# EAGLE design ioboard (EAGLE 9.6.2)
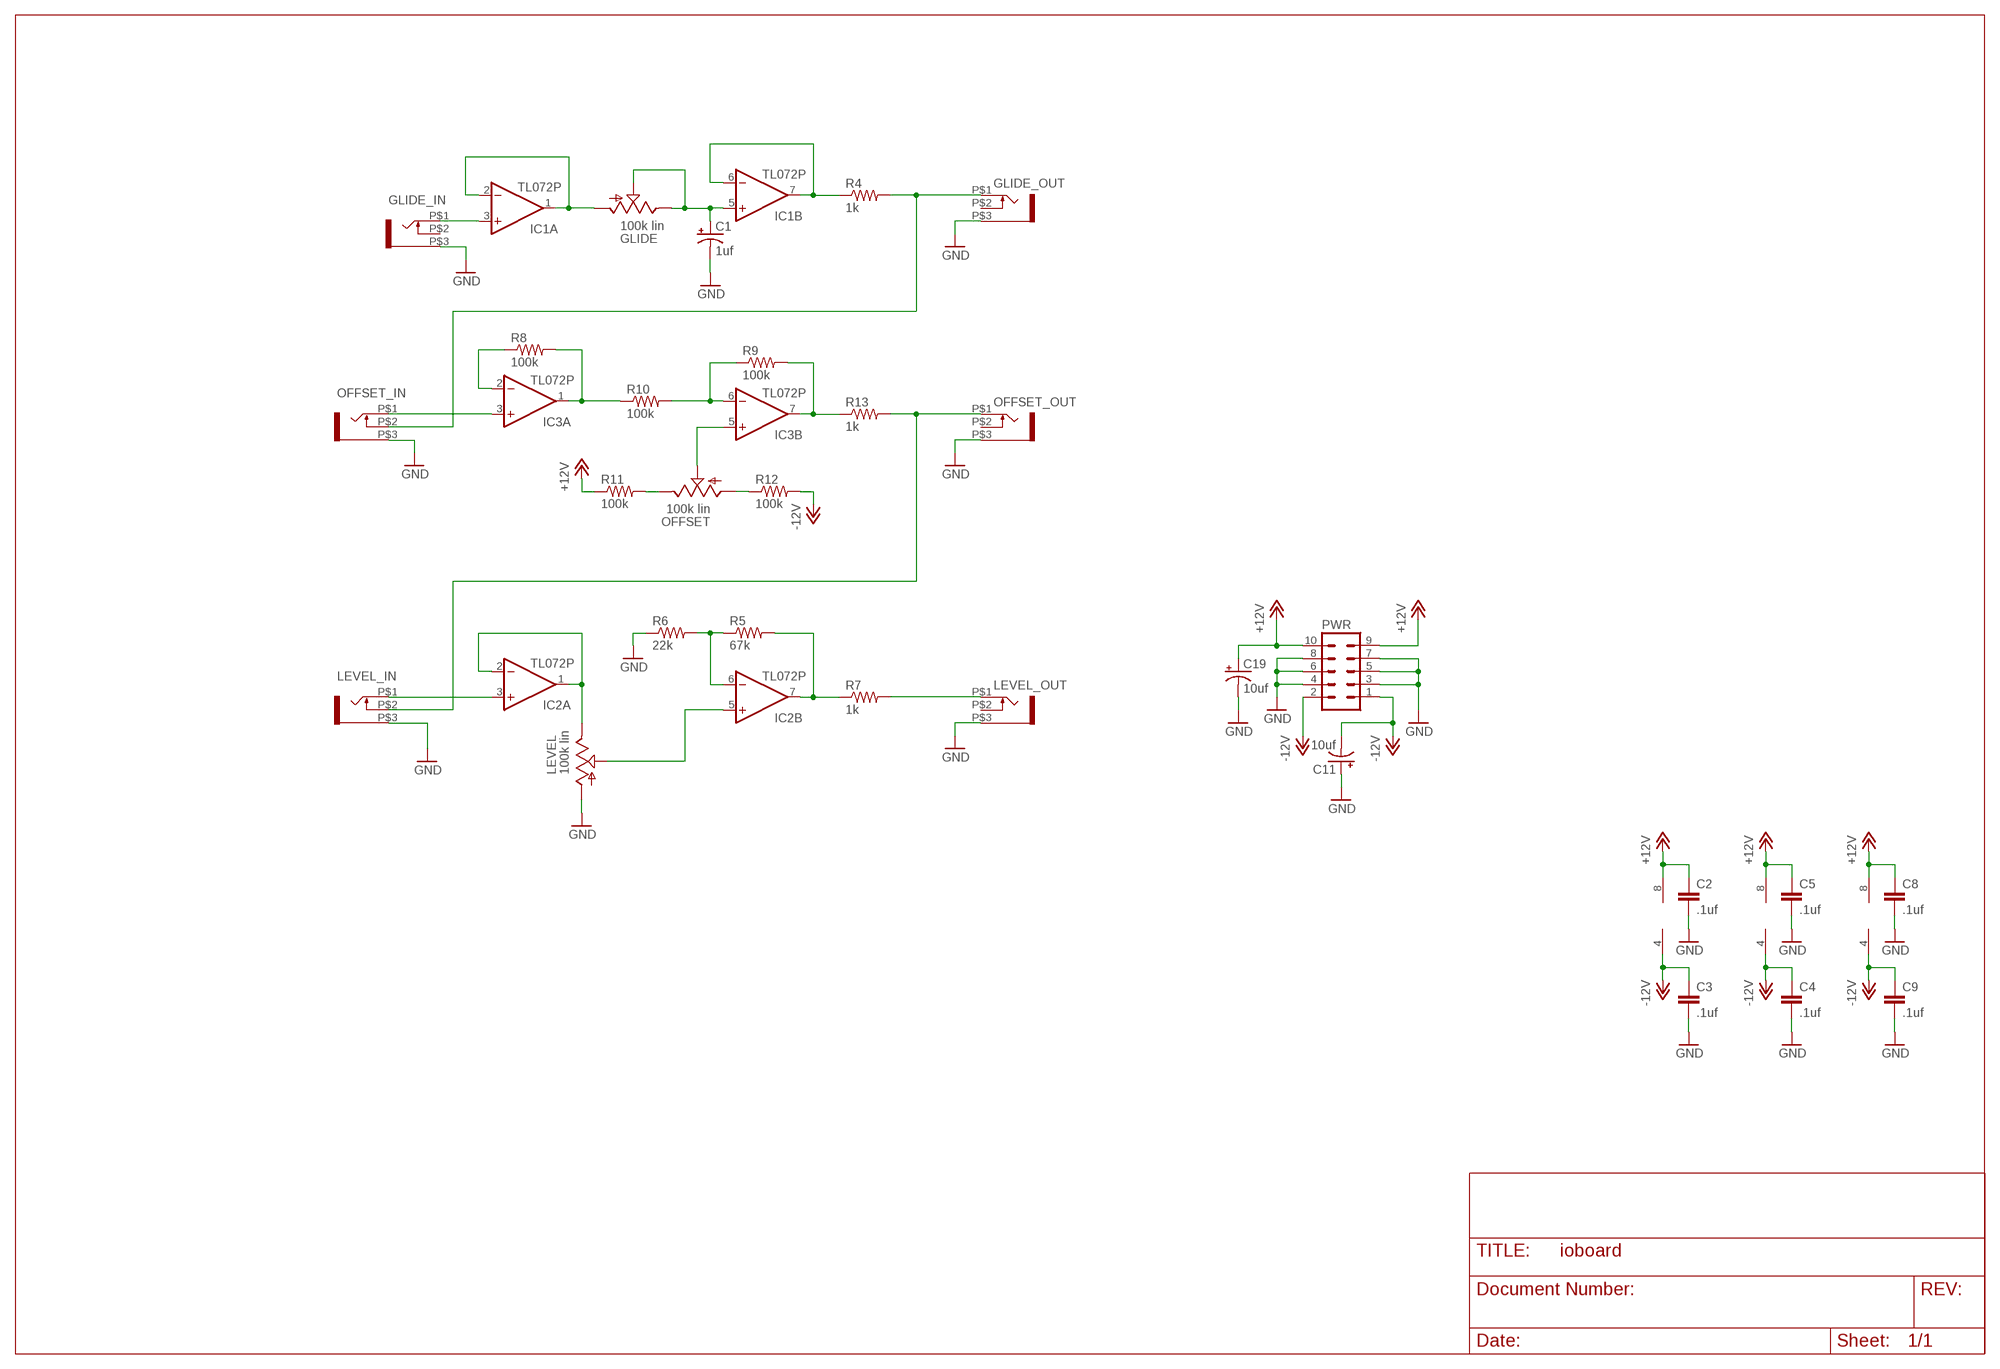
[diagram p0: schematic, sheet 1]

## Parts
C1  1uf  CPOL-USE2.5-6  [E2,5-6]
C2  .1uf  C-EU050-024X044  [C050-024X044]
C3  .1uf  C-EU050-024X044  [C050-024X044]
C4  .1uf  C-EU050-024X044  [C050-024X044]
C5  .1uf  C-EU050-024X044  [C050-024X044]
C8  .1uf  C-EU050-024X044  [C050-024X044]
C9  .1uf  C-EU050-024X044  [C050-024X044]
C11  10uf  CPOL-USE2.5-5  [E2,5-5]
C19  10uf  CPOL-USE2.5-5  [E2,5-5]
GLIDE  100k lin  ALPHA-9MMA  [EVUF]
GLIDE_IN  WQP-PJ301M-12_JACK  [WQP-PJ301M-12_JACK]
GLIDE_OUT  WQP-PJ301M-12_JACK  [WQP-PJ301M-12_JACK]
IC1  TL072P  [DIL08]
IC2  TL072P  [DIL08]
IC3  TL072P  [DIL08]
LEVEL  100k lin  ALPHA-9MMA  [EVUF]
LEVEL_IN  WQP-PJ301M-12_JACK  [WQP-PJ301M-12_JACK]
LEVEL_OUT  WQP-PJ301M-12_JACK  [WQP-PJ301M-12_JACK]
OFFSET  100k lin  ALPHA-9MMA  [EVUF]
OFFSET_IN  WQP-PJ301M-12_JACK  [WQP-PJ301M-12_JACK]
OFFSET_OUT  WQP-PJ301M-12_JACK  [WQP-PJ301M-12_JACK]
PWR  ML10  [ML10]
R4  1k  R-US_0204/7  [0204/7]
R5  67k  R-US_0204/7  [0204/7]
R6  22k  R-US_0204/7  [0204/7]
R7  1k  R-US_0204/7  [0204/7]
R8  100k  R-US_0204/7  [0204/7]
R9  100k  R-US_0204/7  [0204/7]
R10  100k  R-US_0204/7  [0204/7]
R11  100k  R-US_0204/7  [0204/7]
R12  100k  R-US_0204/7  [0204/7]
R13  1k  R-US_0204/7  [0204/7]

## Nets
+12V: C2.1 C5.1 C8.1 C19.+ IC1.8(P:V+) IC2.8(P:V+) IC3.8(P:V+) PWR.9 PWR.10 R11.1
-12V: C3.1 C4.1 C9.1 C11.- IC1.4(P:V-) IC2.4(P:V-) IC3.4(P:V-) PWR.1 PWR.2 R12.2
GND: C1.- C2.2 C3.2 C4.2 C5.2 C8.2 C9.2 C11.+ C19.- GLIDE_IN.P$3 GLIDE_OUT.P$3 LEVEL.1(A) LEVEL_IN.P$3 LEVEL_OUT.P$3 OFFSET_IN.P$3 OFFSET_OUT.P$3 PWR.3 PWR.4 PWR.5 PWR.6 PWR.7 PWR.8 R6.1
IO_LEVEL_W: IC2.5(B:+IN) LEVEL.2(S)
IO_OFFSET_IN: IC3.3(A:+IN) OFFSET_IN.P$1
IO_OFFSET_OUT: LEVEL_IN.P$2 OFFSET_OUT.P$1 R13.2
IO_SLIDE_A: GLIDE.1(A) IC1.1(A:OUT) IC1.2(A:-IN)
IO_SLIDE_B: C1.+ GLIDE.2(S) GLIDE.3(E) IC1.5(B:+IN)
IO_SLIDE_IN: GLIDE_IN.P$1 IC1.3(A:+IN)
M_LEVEL_A: IC2.1(A:OUT) IC2.2(A:-IN) LEVEL.3(E)
M_LEVEL_IN: IC2.3(A:+IN) LEVEL_IN.P$1
M_LEVEL_OUT: LEVEL_OUT.P$1 R7.2
M_OFFSET: IC3.5(B:+IN) OFFSET.2(S)
M_SLIDE_OUT: GLIDE_OUT.P$1 OFFSET_IN.P$2 R4.2
N$4: IC1.6(B:-IN) IC1.7(B:OUT) R4.1
N$9: IC2.6(B:-IN) R5.1 R6.2
N$10: IC2.7(B:OUT) R5.2 R7.1
N$11: IC3.6(B:-IN) R9.1 R10.2
N$12: IC3.1(A:OUT) R8.2 R10.1
N$13: IC3.2(A:-IN) R8.1
N$14: IC3.7(B:OUT) R9.2 R13.1
N$17: OFFSET.1(A) R12.1
N$18: OFFSET.3(E) R11.2
Unconnected: GLIDE_IN.P$2 GLIDE_OUT.P$2 LEVEL_OUT.P$2 OFFSET_OUT.P$2

## Library data of the parts
C1 C11 C19 = resistor:CPOL-US: POLARIZED CAPACITOR, American symbol
C2-C5 C8 C9 = resistor:C-EU: CAPACITOR, European symbol
GLIDE LEVEL OFFSET = TomW:ALPHA-9MM: 9 mm Square Rotary Potentiometers Source: Panasonic
GLIDE_IN GLIDE_OUT LEVEL_IN LEVEL_OUT OFFSET_IN OFFSET_OUT = thonkiconn:WQP-PJ301M-12_JACK
IC1-IC3 = TomW:TL072: OP AMP
PWR = con-ml:ML10: HARTING; OC_FARNELL: unknown; OC_NEWARK: unknown
R4-R13 = resistor:R-US_: RESISTOR, American symbol

## Board
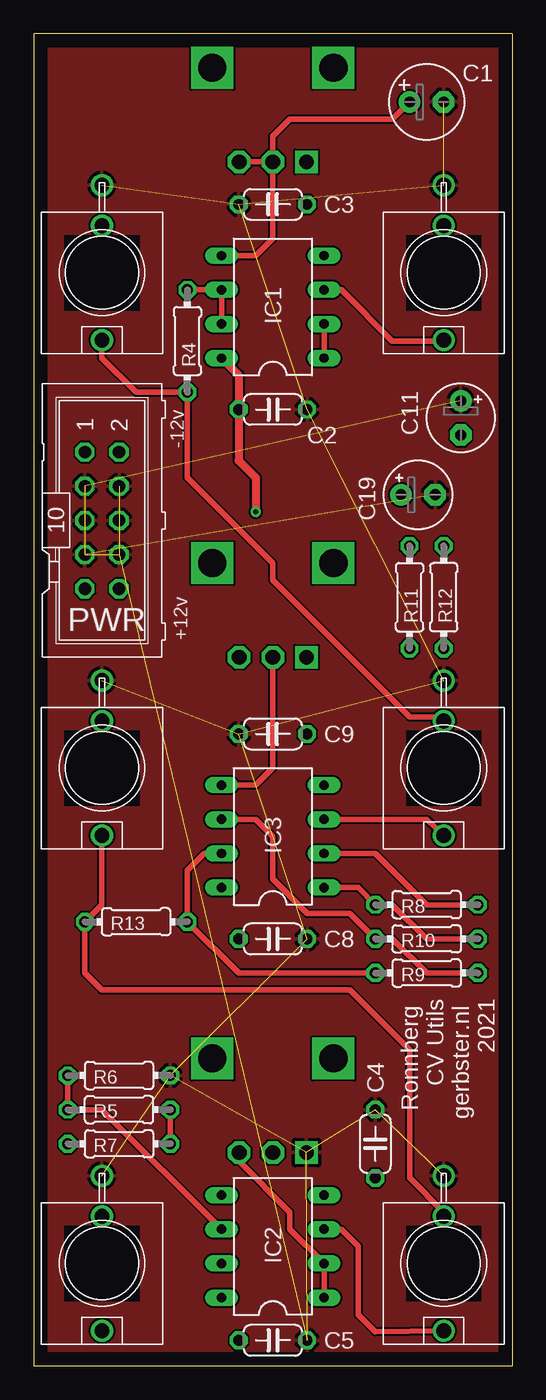
[diagram p1: board, top side]
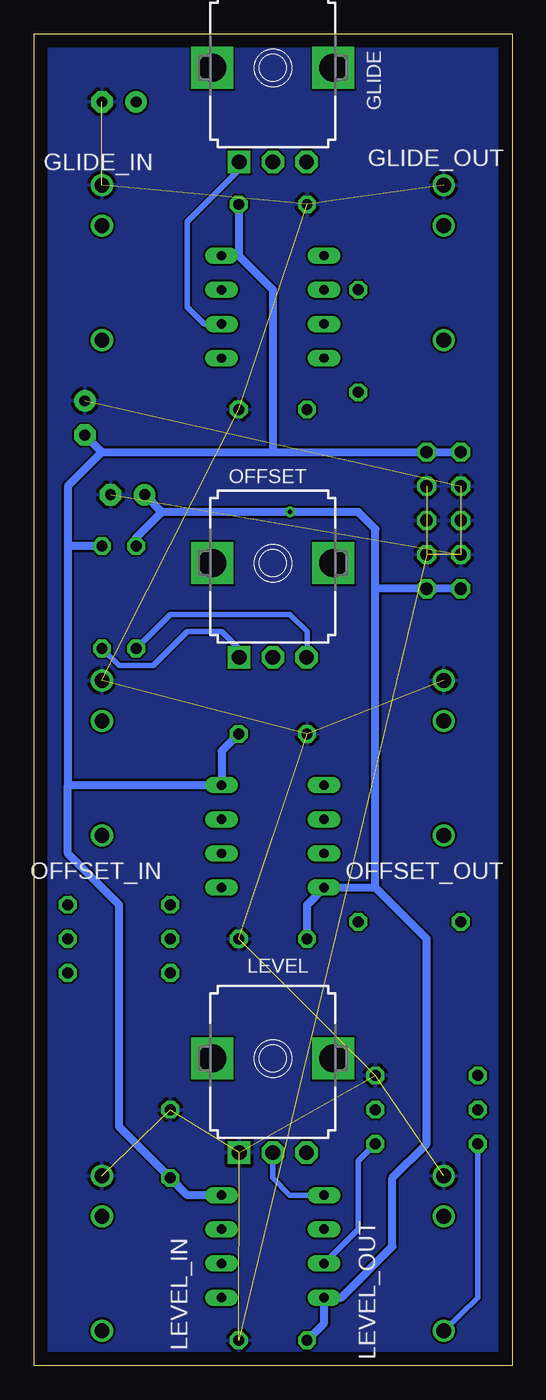
[diagram p2: board, bottom side, seen from below]

Size 35.56 x 99.06 mm. Coordinates in mm from the lower left corner, seen from the top.
Outline: 0,0 35.56,0 35.56,99.06 0,99.06 0,0
Copper layers (1*16): Top 0.035mm / dielectric 1.5mm / Bottom 0.035mm
Design rules "default": minimum track width 6mil, minimum drill 0.35mm, track to track 6mil, track to pad 6mil, pad to pad 6mil, via to via 6mil, smd to smd 6mil, copper to edge 40mil, drill to drill 6mil, minimum pad ring 10mil, minimum via ring 8mil, stop-mask expansion 4mil, vias tented up to drill 0mil, thermal gap 10mil

### Footprints (pad centres in the part's own frame; a part is rotated, then mirrored left to right if it is on the bottom)
E2,5-6 = drill 0.813 pad 1.6: + -1.27,0 | drill 0.813 pad 1.6 octagon: - 1.27,0
C050-024X044 = drill 0.813 octagon: 1 -2.54,0; 2 2.54,0
E2,5-5 = drill 0.813 pad 1.6: + -1.27,0 | drill 0.813 pad 1.6 octagon: - 1.27,0
EVUF = drill 1.1 pad 1.676 square: 1 -2.5,-7 | drill 1.1 pad 1.676 octagon: 2 0,-7; 3 2.5,-7 | drill 2.1 pad 2.8 square: M1 4.5,0; M2 -4.5,0
WQP-PJ301M-12_JACK = drill 1.1: P$1 0,5; P$2 0,-3.5; P$3 0,-6.5
DIL08 = drill 0.7 long: 1 -3.81,-3.81; 2 -1.27,-3.81; 3 1.27,-3.81; 4 3.81,-3.81; 5 3.81,3.81; 6 1.27,3.81; 7 -1.27,3.81; 8 -3.81,3.81
ML10 = drill 0.914 octagon: 1 -5.08,-1.27; 2 -5.08,1.27; 3 -2.54,-1.27; 4 -2.54,1.27; 5 0,-1.27; 6 0,1.27; 7 2.54,-1.27; 8 2.54,1.27; 9 5.08,-1.27; 10 5.08,1.27
0204/7 = drill 0.813 octagon: 1 -3.81,0; 2 3.81,0

### Placement (x,y rotation side)
C1  29.21,93.98 0 top
C2  17.78,71.12 0 top
C3  17.78,86.36 180 top
C4  25.4,16.51 90 top
C5  17.78,1.91 0 top
C8  17.78,31.75 0 top
C9  17.78,46.99 180 top
C11  31.75,70.48 270 top
C19  28.57,64.77 0 top
GLIDE  17.78,96.52 0 bottom
GLIDE_IN  30.48,81.28 180 top
GLIDE_OUT  5.08,81.28 180 top
IC1  17.78,78.74 90 top
IC2  17.78,8.89 90 top
IC3  17.78,39.37 90 top
LEVEL  17.78,22.86 0 bottom
LEVEL_IN  30.48,7.62 180 top
LEVEL_OUT  5.08,7.62 180 top
OFFSET  17.78,59.69 0 bottom
OFFSET_IN  30.48,44.45 180 top
OFFSET_OUT  5.08,44.45 180 top
PWR  5.08,62.87 270 top
R4  11.43,76.2 270 top
R5  6.35,19.05 0 top
R6  6.35,21.59 180 top
R7  6.35,16.51 180 top
R8  29.21,34.29 180 top
R9  29.21,29.21 180 top
R10  29.21,31.75 180 top
R11  27.94,57.15 270 top
R12  30.48,57.15 90 top
R13  7.62,33.02 180 top

### Tracks (layer width: path | path; a pad name or v marks a point on that pad's centre or on a via)
+12V  (via drill 0.35)
  Top 0.61: IC1.8 15.24,73.66 C2.1 15.24,67.31 16.51,66.04 v16.51,63.5
  Bottom 0.61: C5.1 13.97,3.17 IC2.8 12.7,5.08 8.89,8.89 8.89,13.97 6.35,16.51 6.35,31.75 10.16,35.56 | 10.16,35.56 IC3.8 15.24,34.29 C8.1 | 10.16,35.56 10.16,57.78 | 10.16,57.78 10.16,62.23 11.43,63.5 v16.51,63.5 26.04,63.5 | 26.04,63.5 27.94,61.59 R11.1 | PWR.9 PWR.10 10.16,57.78 | C19.+ 26.04,63.5
-12V
  Bottom 0.61: C3.1 20.32,82.55 | IC1.4 20.32,82.55 | 20.32,82.55 17.78,80.01 17.78,67.94 | IC2.4 24.13,12.7 C4.1 29.21,17.78 29.21,34.29 33.02,38.1 33.02,43.18 | 33.02,43.18 IC3.4 21.59,45.72 C9.1 | 30.48,67.94 33.02,65.41 33.02,60.96 | 33.02,60.96 33.02,43.18 | R12.2 33.02,60.96 | 17.78,67.94 PWR.2 PWR.1 | 30.48,67.94 17.78,67.94 | C11.- 30.48,67.94
GND  (22 unrouted)
  pour Top: 0,99.06 35.56,99.06 35.56,0 0,0
  pour Bottom: 0,99.06 35.56,99.06 35.56,0 0,0
IO_LEVEL_W
  Bottom 0.406: LEVEL.2 17.78,13.97 16.51,12.7 IC2.5
IO_OFFSET_IN
  Top 0.406: IC3.3 29.21,40.64 OFFSET_IN.P$1
IO_OFFSET_OUT
  Top 0.406: OFFSET_OUT.P$1 5.08,34.29 R13.2 3.81,29.21 5.08,27.94 23.5,27.94 27.94,23.5 27.94,13.97 30.48,11.43 LEVEL_IN.P$2
IO_SLIDE_A
  Top 0.406: IC1.2 IC1.1
  Bottom 0.406: GLIDE.1 20.32,88.9 24.13,85.09 24.13,78.74 22.86,77.47 IC1.2
IO_SLIDE_B
  Top 0.406: IC1.5 16.51,82.55 17.78,83.82 GLIDE.2 GLIDE.3 17.78,89.53 17.78,91.44 19.05,92.71 26.67,92.71 C1.+
IO_SLIDE_IN
  Top 0.406: GLIDE_IN.P$1 30.48,76.2 26.67,76.2 22.86,80.01 IC1.3
M_LEVEL_A
  Top 0.406: IC2.1 IC2.2 19.05,10.16 19.05,11.43 15.24,15.24 15.24,15.86 LEVEL.3
M_LEVEL_IN
  Top 0.406: IC2.3 22.86,10.16 24.13,8.89 24.13,3.81 25.4,2.54 LEVEL_IN.P$1
M_LEVEL_OUT
  Bottom 0.406: R7.2 2.54,5.08 LEVEL_OUT.P$1
M_OFFSET
  Top 0.406: OFFSET.2 17.78,44.45 16.51,43.18 IC3.5
M_SLIDE_OUT
  Top 0.406: GLIDE_OUT.P$1 5.08,74.93 7.62,72.39 R4.2 11.43,66.04 17.78,59.69 17.78,58.42 27.94,48.26 30.48,48.26 OFFSET_IN.P$2
N$4
  Top 0.406: IC1.7 IC1.6 R4.1
N$9
  Top 0.406: R6.2 R5.1 5.08,19.05 IC2.6
N$10
  Top 0.406: R5.2 R7.1
  Bottom 0.406: R7.1 11.43,15.24 11.43,10.16 IC2.7
N$11
  Top 0.406: IC3.6 16.51,40.64 17.78,39.37 17.78,36.2 20.32,33.66 23.5,33.66 R10.2 26.67,31.75 29.21,29.21 R9.1
N$12
  Top 0.406: R10.1 29.21,31.75 26.67,34.29 R8.2 24.13,35.56 IC3.1
N$13
  Top 0.406: IC3.2 25.4,38.1 29.21,34.29 R8.1
N$14
  Top 0.406: IC3.7 12.7,38.1 11.43,36.83 R13.1 15.24,29.21 R9.2
N$17
  Bottom 0.406: R12.1 29.21,52.07 26.67,52.07 24.13,54.61 21.59,54.61 20.32,53.34 20.32,52.69 OFFSET.1
N$18
  Bottom 0.406: R11.2 25.4,55.88 16.51,55.88 15.24,54.61 15.24,52.69 OFFSET.3

### Text on the board
tNames: -12v | +12v | Ronnberg / CV Utils / gerbster.nl / 2021